# Altium schematic sheet MainBoard_V100_TEMP.SchDoc
size A4; SheetNumber: 22; SheetTotal: 22; Title_: Temperature Sensor
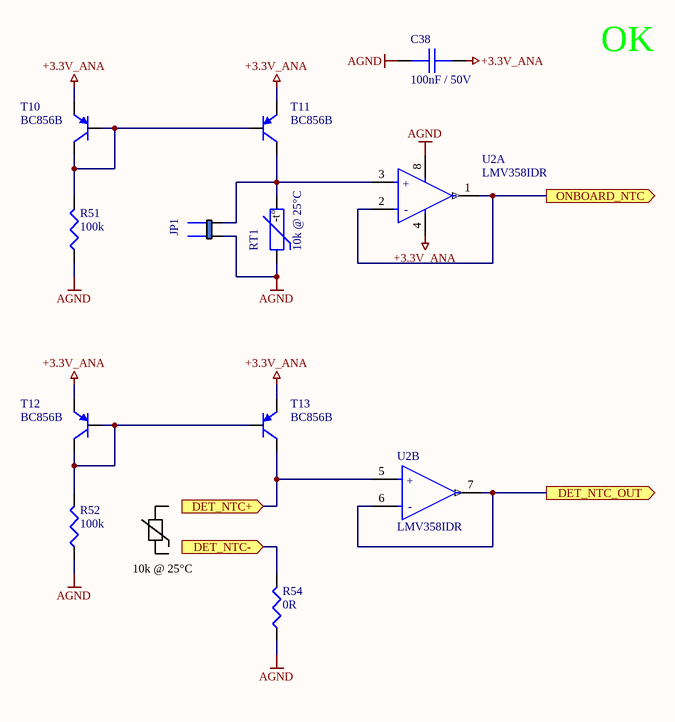
[diagram p0: MainBoard_V100_TEMP.SchDoc]

## Parts
C38  100nF / 50V  [0805_C]
JP1  JUMPER2 2.54MM  [JUMPER_5]  (value not drawn)
R51  100k  [0805]
R52  100k  [0805]
R54  0R  [0805]
RT1  10k @ 25°C  [0805]
T10  BC856B  [SOT-23]
T11  BC856B  [SOT-23]
T12  BC856B  [SOT-23]
T13  BC856B  [SOT-23]
U2  LMV358IDR  [SO-8]  (parts A,B of 2)

## Ports
DET_NTC+ (in), DET_NTC- (in), DET_NTC_OUT (out), ONBOARD_NTC (out)

## Nets
+3.3V_ANA: C38.2 T10.2(E) T11.2(E) T12.2(E) T13.2(E) U2.4(GND)
AGND: C38.1 JP1.1 R51.1 R52.1 R54.1 RT1.1 U2.8(VCC+)
DET_NTC+: T13.3(C) U2.5(2IN+) ; port DET_NTC+
DET_NTC-: R54.2 ; port DET_NTC-
DET_NTC_OUT: U2.6(2IN-) U2.7(2OUT) ; port DET_NTC_OUT
ONBOARD_NTC: U2.1(OUT) U2.2(1IN-) ; port ONBOARD_NTC
NetJP1_2: JP1.2 RT1.2 T11.3(C) U2.3(1IN+)
NetR51_2: R51.2 T10.1(B) T10.3(C) T11.1(B)
NetR52_2: R52.2 T12.1(B) T12.3(C) T13.1(B)

## Notes on the sheet
- OK
- 10k @ 25°C
- Board:
- Author:
- Title:
- Project:
- SVN:
- Version:
- Sheet:
- of
- Contact:
- Modified:
- Size:
- A4
- (in symbol 325) -t°
- (in symbol 352, part A) +; -
- (in symbol 352, part B) +; -

## Library data of the parts
C38 = 149: 100nF 50V X7R; Part Number: SMD0805-100nF-50V; Azonosító: 149; Category: Passives; Subcategory: PASS_Capacitor; Supplier 1: HESTORE; Supplier 1 order number: 100.011.22
JP1 = 246: Azonosító: 246; Part Number: JUMPER2 2.54MM; Category: Connectors; Subcategory: CONN_Other; Supplier 1: FARNELL; Supplier 1 order number: 2356153
R51 R52 = 66: 100k 0805 0.125W 5%; Part Number: SMD0805-100k 5%; Azonosító: 66; Category: Passives; Subcategory: PASS_Resistor; Supplier 1: HESTORE; Supplier 1 order number: 100.011.43
R54 = 38: 0R 0805 0.125W 5%; Part Number: 0 R 5%; Azonosító: 38; Category: Passives; Subcategory: PASS_Resistor; Supplier 1: HESTORE; Supplier 1 order number: 100.275.70
RT1 = 325: NTC (Negative Temperature Coefficient) Thermistors THERMISTOR 0805 10K/3435; Part Number: TX08F103F3435ER; Azonosító: 325; Category: Passives; Subcategory: PASS_Other; Supplier 1: MOUSER; Supplier 1 order number: 588-TX08F103F3435ER
T10-T13 = 312: BC856B Bipolar (BJT) Single Transistor, PNP, 65 V, 100 mA, 250 mW, SOT-23, Surface Mount; Azonosító: 312; Part Number: BC856B; Category: Semiconductors; Subcategory: SEMI_Transistor; Supplier 1: HESTORE; Supplier 1 order number: 100.001.06; Supplier 2: MOUSER; Supplier 2 order number: 637-BC856B; Help URL: https://hu.mouser.com/datasheet/2/849/bc856-3324318.pdf
U2 = 352: IC OPAMP GP 2 CIRCUIT 8SOIC; Number of Elements: 2; Min Supply Voltage: 2.7V; Input Bias Current: 250nA; Output Current per Channel: 160mA; Bandwidth: 1MHz; Voltage Gain: 100dB; Input Offset Voltage (Vos): 7mV; Slew Rate: 1V/µs; Nominal Supply Current: 440uA; Power Supply Rejection Ratio (PSRR): 50dB; Max Supply Voltage: 5.5V; Operating Supply Current: 210uA; Azonosító: 352; Lead Free: Lead Free; Length: 4.9mm; RoHS Compliant: Yes; REACH SVHC: No SVHC; Case/Package: SOIC; Height: 1.58mm; Number of Channels: 2; Number of Amplifiers: 2; Radiation Hardening: No; Number of Circuits: 2; Mount: Surface Mount; Contact Plating: Gold; Unity Gain Bandwidth Product: 1MHz; Min Operating Temperature: -40°C; Max Operating Temperature: 125°C; Width: 3.91mm; Gain Bandwidth Product: 1MHz; Number of Pins: 8; Packaging: Tape and Reel; Package Quantity: 2500; Output Current: 160mA; Common Mode Rejection Ratio: 50dB; Part Number: LMV358IDR; Category: Integrated Circuits; Subcategory: IC_Analog; Supplier 1: MOUSER; Supplier 1 order number: 595-LMV358IDRE4; Help URL: https://www.ti.com/lit/ds/symlink/lmv358.pdf?HQS=dis-mous-null-mousermode-dsf-pf-null-wwe&ts=1703732015551